# Altium schematic sheet High-Side Driver.SchDoc: High-Side Driver
size A4; Date: 2014-10-14; DocumentNumber: 23; Revision: A; SheetNumber: 23; SheetTotal: 43; DesignedBy: Craig Comberbach
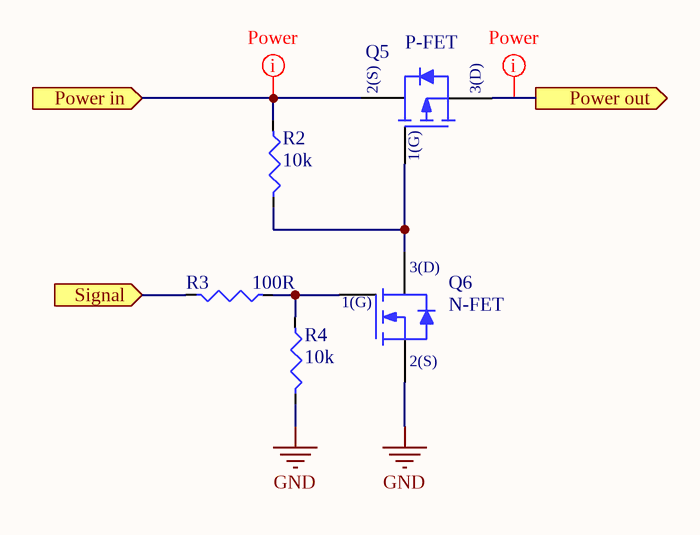
[diagram p0: High-Side Driver.SchDoc]

## Parts
Q5  P-FET  [SOT23 - 3 pin]
Q6  N-FET  [SOT23 - 3 pin]
R2  Resistance (Ohms): 10k  [Resistor - 1206]
R3  Resistance (Ohms): 100R  [Resistor - 1206]  (hidden comment: 2k 1206 5%)
R4  Resistance (Ohms): 10k  [Resistor - 1206]

## Ports
Power in (in), Power out (out), Signal (in)

## Nets
GND: Q6.2(Source) R4.2
Power in: Q5.2(Source) R2.1 ; port Power in
Power out: Q5.3(Drain) ; port Power out
Signal: R3.1 ; port Signal
NetQ5_1: Q5.1(Gate) Q6.3(Drain) R2.2
NetQ6_1: Q6.1(Gate) R3.2 R4.1

## Layout directives
net class Power: Power in, Power out

## Notes on the sheet
- Cct
- Designed by
- Rev
- Date
- Sheet       of
- (in symbol N Channel MOSFET) 3(D); 1(G); 2(S)
- (in symbol P Channel MOSFET 3.5A) 2(S); 3(D); 1(G)

## Library data of the parts
Q5 = P Channel MOSFET 3.5A: P Channel MOSFET; Manufacturer: Diodes Incorporated; Manufacturer Part Number: DMP3130L-7; FET Type: MOSFET P-Channel, Metal Oxide; FET Feature: Logic Level Gate; Drain to Source Voltage (Vdss): 30V; Current - Continuous Drain (Id) @ 25°C: 3.5A (Ta); Rds On (Max) @ Id, Vgs: 77 mOhm @ 4.2A, 10V; Vgs(th) (Max) @ Id: 1.3V @ 250µA; Gate Charge (Qg) @ Vgs: 12nC @ 10V; Input Capacitance (Ciss) @ Vds: 432pF @ 15V; Power - Max: 1.4W; Price P/N: 020166-006; Technology: SMT; Value: P Channel MOSFET; Supplier 1: Digi-Key; Supplier Part Number 1: DMP3130LDICT-ND; RoHS: RoHS Compliant; Category: Discrete Semiconductor Products; Stock 1: 76890; Pricing 1: 1=0.57, 10=0.444, 25=0.3736, 100=0.3047, 250=0.2524, 500=0.20848, 1000=0.15615 (CAD); Packaging: Cut Tape (CT); Mounting Type: Surface Mount; Package / Case: TO-236-3, SC-59, SOT-23-3; Supplier Device Package: SOT-23-3; ComponentLink1URL: http://www.diodes.com/datasheets/ds31524.pdf; ComponentLink1Description: Spec Sheet
Q6 = N Channel MOSFET: Manufacturer: NXP Semiconductors; Manufacturer Part Number: 2N7002,215; QuickValue: 2N7002; FET Type: MOSFET N-Channel, Metal Oxide; FET Feature: Logic Level Gate; Drain to Source Voltage (Vdss): 60V; Current - Continuous Drain (Id) @ 25°C: 300mA (Ta); Rds On (Max) @ Id, Vgs: 5 Ohm @ 500mA, 10V; Vgs(th) (Max) @ Id: 2.5V @ 250µA; Input Capacitance (Ciss) @ Vds: 50pF @ 10V; Power - Max: 830mW; Price P/N: 020166-005; Technology: SMT; Value: N Channel MOSFET; Supplier 1: Digi-Key; Supplier Part Number 1: 568-1369-1-ND; RoHS: RoHS Compliant; Category: Discrete Semiconductor Products; Stock 1: 765228; Pricing 1: 1=0.18, 10=0.167, 25=0.1512, 100=0.109, 250=0.06416, 500=0.05324, 1000=0.03632 (CAD); Packaging: Cut Tape (CT); Gate Charge (Qg) @ Vgs: -; Mounting Type: Surface Mount; Package / Case: TO-236-3, SC-59, SOT-23-3; Supplier Device Package: SOT-23 (TO-236AB); ComponentLink1URL: http://www.nxp.com/documents/data_sheet/2N7002.pdf; ComponentLink1Description: Spec Sheet
R2 R4 = 10k 1206 1%: Resistor; Manufacturer: Vishay Dale; Manufacturer Part Number: CRCW120610K0FKEA; Tolerance: ±1%; Power (Watts): 0.25W, 1/4W; Temperature Coefficient: ±100ppm/°C; Price P/N: 020100-004; Technology: SMT; Value: 10k 1206 1%; Supplier 1: Digi-Key; Supplier Part Number 1: 541-10.0KFCT-ND; RoHS: RoHS Compliant; Category: Resistors; Stock 1: 393912; Pricing 1: 10=0.131, 50=0.0704, 200=0.0404, 1000=0.02755 (CAD); Packaging: Cut Tape (CT); Composition: Thick Film; Features: Automotive AEC-Q200 Qualified; Package / Case: 1206 (3216 Metric); Supplier Device Package: 1206 (3216 Metric); Size / Dimension: 0.126" L x 0.063" W (3.20mm x 1.60mm); Height: 0.024" (0.60mm); Number of Terminations: 2; ComponentLink1URL: http://www.vishay.com/docs/20035/dcrcwe3.pdf; ComponentLink1Description: Spec Sheet
R3 = 2k 1206 5%: Resistor; Manufacturer: Yageo; Manufacturer Part Number: RC1206FR-07100RL; Description: RES SMD 100 OHM 1% 1/4W 1206; Tolerance: ±1%; Power (Watts): 0.25W, 1/4W; Temperature Coefficient: ±100ppm/°C; Technology: SMT; Value: 2k 1206 5%; Supplier 1: Digi-Key; Supplier Part Number 1: 311-100FRCT-ND; RoHS: RoHS Compliant; Category: Resistors; Stock 1: 1567506; Pricing 1: 1=0.15, 10=0.044, 25=0.032, 50=0.0242, 100=0.0178, 250=0.0136, 500=0.01088, 1000=0.00801 (CAD); Packaging: Cut Tape (CT); Part Status: Active; Composition: Thick Film; Features: Moisture Resistant; Operating Temperature: -55°C ~ 155°C; Package / Case: 1206 (3216 Metric); Supplier Device Package: 1206; Size / Dimension: 0.122" L x 0.063" W (3.10mm x 1.60mm); Height - Seated (Max): 0.026" (0.65mm); Failure Rate: -; ComponentLink1URL: http://www.yageo.com/documents/recent/PYu-RC_Group_51_RoHS_L_6.pdf; ComponentLink1Description: http://www.yageo.com/documents/recent/PYu-RC_Group_51_RoHS_L_6.pdf